# Altium schematic sheet fpga-bank8-inside.SchDoc: FPGA - Bank 8
size Letter; CheckedBy: E. Chiu; CompanyName: Brinton Engineering, LLC; DrawnBy: J. Brinton; Engineer: J. Brinton; Address1: 3479 Edison Way; Address2: Menlo Park CA 94025; Address3: +1 (877) 778-8435; Address4: brintonengineering.com; Revision: 1; SheetNumber: 14; SheetTotal: 60
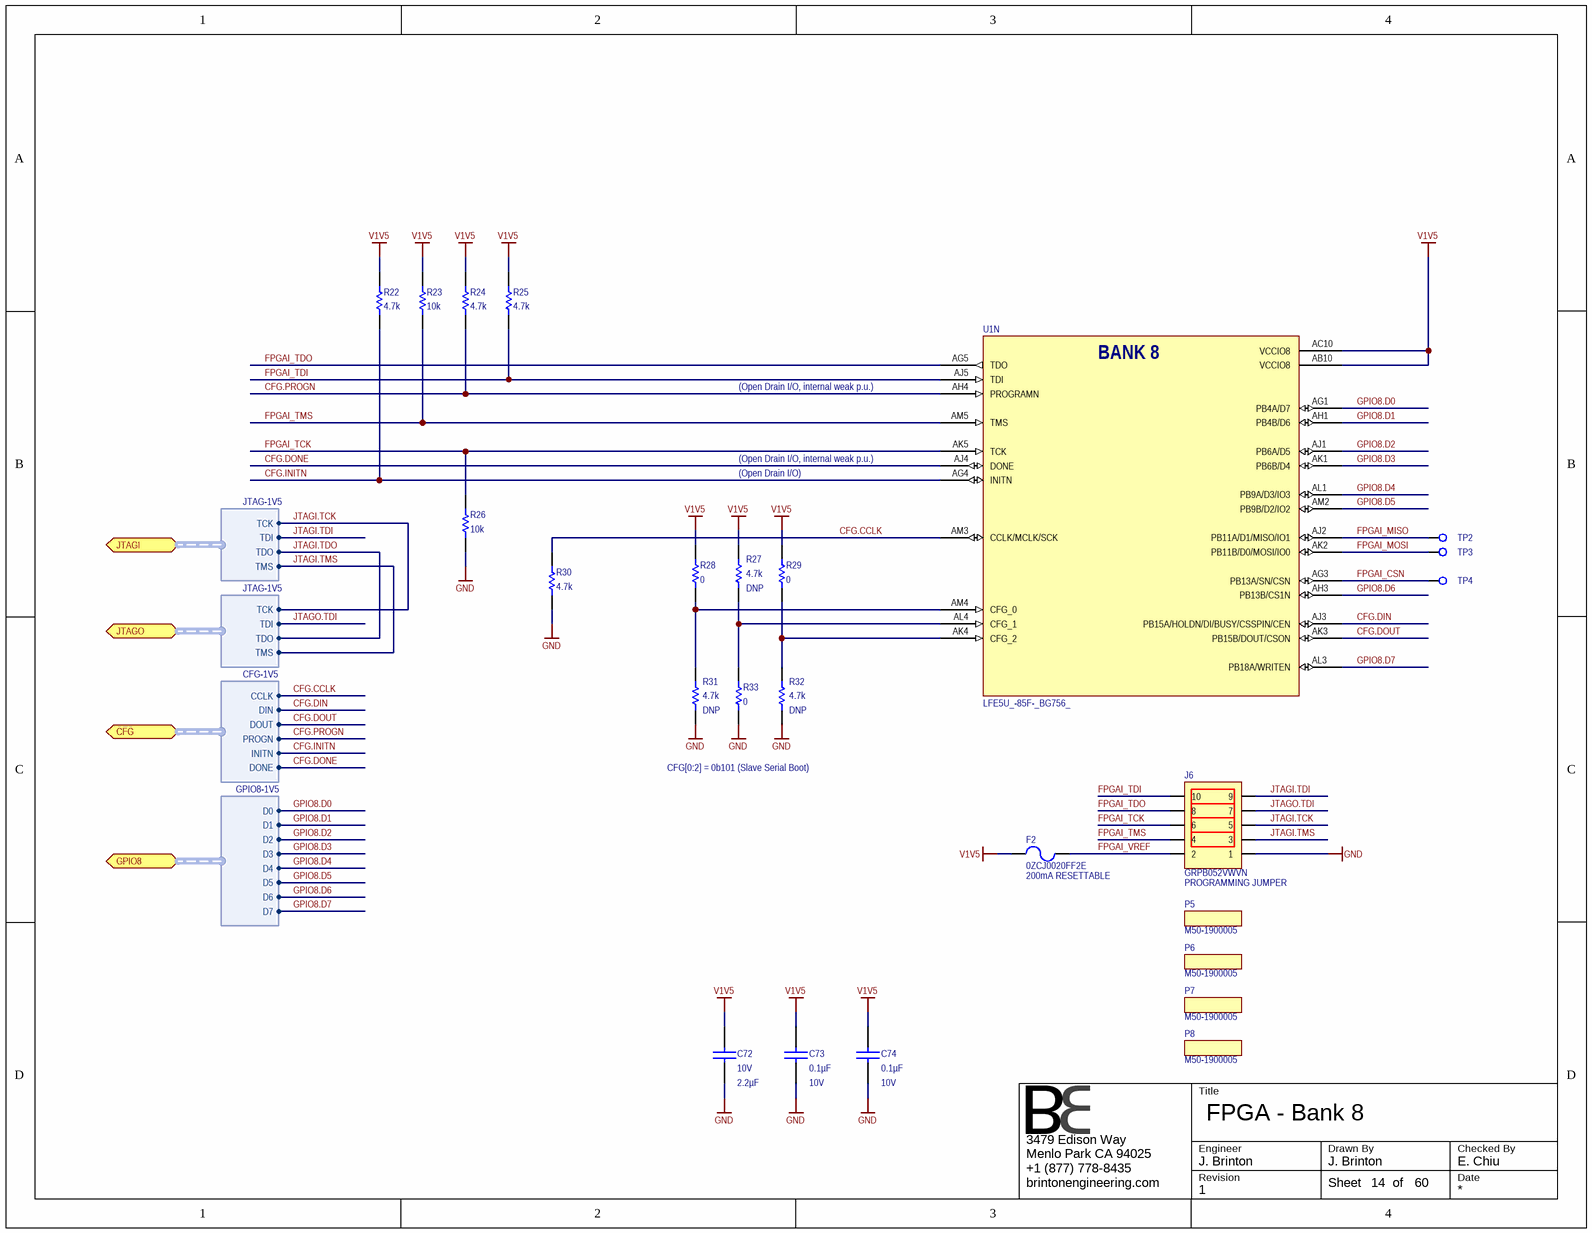
[diagram p0: fpga-bank8-inside.SchDoc]

## Parts
C72  Voltage - Rated: 10V  Capacitance: 2.2µF  [CAPC1608X90N]  (hidden comment: GRM188R71A225KE15D)
C73  Capacitance: 0.1µF  Voltage - Rated: 10V  [CAPC1005X56N]  (hidden comment: GRM155R71A104KA01J)
C74  Capacitance: 0.1µF  Voltage - Rated: 10V  [CAPC1005X56N]  (hidden comment: GRM155R71A104KA01J)
F2  0ZCJ0020FF2E  [1206]
J6  GRPB052VWVN  [GRPB052VWVN]
P5  M50-1900005  (mechanical)
P6  M50-1900005  (mechanical)
P7  M50-1900005  (mechanical)
P8  M50-1900005  (mechanical)
R22  value 4.7k  [0603]  (hidden comment: RES 0603 4.7k 1%)
R23  value 10k  [0603]  (hidden comment: ERJ-3EKF1002V)
R24  value 4.7k  [0603]  (hidden comment: RES 0603 4.7k 1%)
R25  value 4.7k  [0603]  (hidden comment: RES 0603 4.7k 1%)
R26  value 10k  [0603]  (hidden comment: ERJ-3EKF1002V)
R27  value 4.7k  Do Not Place: DNP  [0603]  (hidden comment: RES 0603 4.7k 1%)
R28  value 0  [0603]  (hidden comment: RES 0603 0)
R29  value 0  [0603]  (hidden comment: RES 0603 0)
R30  value 4.7k  [0603]  (hidden comment: RES 0603 4.7k 1%)
R31  value 4.7k  Do Not Place: DNP  [0603]  (hidden comment: RES 0603 4.7k 1%)
R32  value 4.7k  Do Not Place: DNP  [0603]  (hidden comment: RES 0603 4.7k 1%)
R33  value 0  [0603]  (hidden comment: RES 0603 0)
TP2  TEST_POINT_SMD_10  [TEST_POINT_SMD_10]  (value not drawn)  (no BOM)
TP3  TEST_POINT_SMD_10  [TEST_POINT_SMD_10]  (value not drawn)  (no BOM)
TP4  TEST_POINT_SMD_10  [TEST_POINT_SMD_10]  (value not drawn)  (no BOM)
U1  LFE5U_-85F-_BG756_  [caBGA756]  (part N of 19)

## Ports
CFG (harness CFG-1V5), GPIO8 (harness GPIO8-1V5), JTAGI (harness JTAG-1V5), JTAGO (harness JTAG-1V5)

## Harnesses
CFG-1V5: CCLK, DIN, DOUT, PROGN, INITN, DONE
GPIO8-1V5: D0, D1, D2, D3, D4, D5, D6, D7
JTAG-1V5: TMS, TCK, TDI, TDO

## Nets
GND: C72.1 C73.1 C74.1 J6.1 R26.1 R30.1 R31.1 R32.1 R33.1
V1V5: C72.2 C73.2 C74.2 F2.1 R22.2 R23.2 R24.2 R25.2 R27.2 R28.2 R29.2 U1.AB10(VCCIO8) U1.AC10(VCCIO8)
CFG.CCLK: R30.2 U1.AM3(CCLK/MCLK/SCK) ; port CFG.CCLK
CFG.DIN: U1.AJ3(PB15A/HOLDN/DI/BUSY/CSSPIN/CEN) ; port CFG.DIN
CFG.DONE: U1.AJ4(DONE) ; port CFG.DONE
CFG.DOUT: U1.AK3(PB15B/DOUT/CSON) ; port CFG.DOUT
CFG.INITN: R22.1 U1.AG4(INITN) ; port CFG.INITN
CFG.PROGN: R24.1 U1.AH4(PROGRAMN) ; port CFG.PROGN
FPGAI_CSN: TP4.1 U1.AG3(PB13A/SN/CSN)
FPGAI_MISO: TP2.1 U1.AJ2(PB11A/D1/MISO/IO1)
FPGAI_MOSI: TP3.1 U1.AK2(PB11B/D0/MOSI/IO0)
FPGAI_TCK: J6.6 R26.2 U1.AK5(TCK)
FPGAI_TDI: J6.10 R25.1 U1.AJ5(TDI)
FPGAI_TDO: J6.8 U1.AG5(TDO)
FPGAI_TMS: J6.4 R23.1 U1.AM5(TMS)
FPGAI_VREF: F2.2 J6.2
GPIO8.D0: U1.AG1(PB4A/D7) ; port GPIO8.D0
GPIO8.D1: U1.AH1(PB4B/D6) ; port GPIO8.D1
GPIO8.D2: U1.AJ1(PB6A/D5) ; port GPIO8.D2
GPIO8.D3: U1.AK1(PB6B/D4) ; port GPIO8.D3
GPIO8.D4: U1.AL1(PB9A/D3/IO3) ; port GPIO8.D4
GPIO8.D5: U1.AM2(PB9B/D2/IO2) ; port GPIO8.D5
GPIO8.D6: U1.AH3(PB13B/CS1N) ; port GPIO8.D6
GPIO8.D7: U1.AL3(PB18A/WRITEN) ; port GPIO8.D7
JTAGI.TCK: J6.5 ; port JTAGI.TCK, port JTAGO.TCK
JTAGI.TDI: J6.9 ; port JTAGI.TDI
JTAGI.TDO: port JTAGI.TDO, port JTAGO.TDO
JTAGI.TMS: J6.3 ; port JTAGI.TMS, port JTAGO.TMS
JTAGO.TDI: J6.7 ; port JTAGO.TDI
NetR27_1: R27.1 R33.2 U1.AL4(CFG_1)
NetR28_1: R28.1 R31.2 U1.AM4(CFG_0)
NetR29_1: R29.1 R32.2 U1.AK4(CFG_2)

## Notes on the sheet
- (Open Drain I/O, internal weak p.u.)
- (Open Drain I/O)
- CFG[0:2] = 0b101 (Slave Serial Boot)
- (near F2) 200mA RESETTABLE
- PROGRAMMING JUMPER
- Title
- Engineer
- Revision
- Drawn By
- Checked By
- Date
- Sheet
- of
- (in symbol LFE5U_-85F-_BG756_, part N) BANK 8

## Library data of the parts
C72 = GRM188R71A225KE15D: CAP CER 2.2UF 10V 10% X7R 0603; Manufacturer: Murata Electronics North America; Manufacturer P/N: GRM188R71A225KE15D; Operating Temperature: -55°C ~ 125°C; Thickness (Max): 0.035" (0.90mm); Tolerance: ±10%; Package / Case: 0603 (1608 Metric); Temperature Coefficient: X7R; Supplier 1: Newark; Supplier 2: Digi-Key; RoHS: RoHS Compliant; Size / Dimension: 0.063" L x 0.031" W (1.60mm x 0.80mm); Mounting Type: Surface Mount, MLCC; ComponentLink1URL: http://www.murata.com/~/media/webrenewal/support/library/catalog/products/capacitor/mlcc/c02e.ashx; ComponentLink1Description: http://www.murata.com/~/media/webrenewal/support/library/catalog/products/capacitor/mlcc/c02e.ashx; Supplier Part Number 1: 72R4209; Supplier Part Number 2: 490-4520-1-ND
C73 C74 = GRM155R71A104KA01J: CAP CER 0.1UF 10V 10% X7R 0402; Manufacturer: Murata Electronics North America; Manufacturer P/N: GRM155R71A104KA01J; Operating Temperature: -55°C ~ 125°C; Thickness (Max): 0.022" (0.55mm); Size / Dimension: 0.039" L x 0.020" W (1.00mm x 0.50mm); RoHS: RoHS Compliant; Mounting Type: Surface Mount, MLCC; Supplier 1: Digi-Key; ComponentLink1URL: http://www.murata.com/~/media/webrenewal/support/library/catalog/products/capacitor/mlcc/c02e.ashx; ComponentLink1Description: http://www.murata.com/~/media/webrenewal/support/library/catalog/products/capacitor/mlcc/c02e.ashx; Supplier Part Number 1: 490-6322-1-ND; Temperature Coefficient: X7R; Package / Case: 0402 (1005 Metric); Tolerance: ±10%
F2 = 0ZCJ0020FF2E: PTC Resettable Fuse, 0.2A, 30V, SMD 1206; Manufacturer: Bell Fuse; Manufacturer P/N: 0ZCJ0020FF2E
J6 = GRPB052VWVN: Male Header, 0.050" Pitch, 2x5 Position; Manufacturer: Sullins; Manufacturer P/N: GRPB052VWVN
P5-P8 = M50-1900005: 1.27mm Jumper Socket; Manufacturer: Harwin; Manufacturer P/N: M50-1900005
R22 R24 R25 R27 R30-R32 = RES 0603 10k 1%: Thick Film Resistor 4.7k Ohms +/-1% 0.1W 75V SMD 0603; Manufacturer: Panasonic - ECG; Manufacturer P/N: ERJ3EKF4701V; Tcr: +/-100; Tr: -55:+155; Tolerance: +/-1%; Alternatives: *; Voltage: 75V; Power: 0.1W; P/N: ERJ3EKF4701V
R23 R26 = RES 0603 10k 1%: Thick Film Resistor 10k Ohms +/-1% 0.1W SMD 0603; Manufacturer: Panasonic - ECG; Tcr: +/-100; Tr: -55:+155; Tolerance: +/-1%; Manufacturer P/N: ERJ-3EKF1002V; Alternatives: *; Power: 0.1W; P/N: ERJ-3EKF1002V
R28 R29 R33 = RES 0603 10k 1%: Thick Film Resistor 0 Ohms SMD 0603; Manufacturer: Panasonic - ECG; Manufacturer P/N: ERJ-3GEY0R00V; Tcr: +/-100; Tolerance: +/-1%; Tr: -55:+155; Voltage: 75V; Power: 0.1W; Alternatives: *; P/N: ERJ-3GEY0R00V
TP2-TP4 = TEST_POINT_SMD_10: Test Point SMD
U1 = LFE5U_-85F-_BG756_: ECP5 FPGA, 85k LUT, 756-caBGA; Manufacturer: Lattice Semiconductor; Manufacturer P/N: LFE5U_-85F-_BG756_